# Altium schematic sheet main.SchDoc
size A2; SheetNumber: 1; SheetTotal: 10
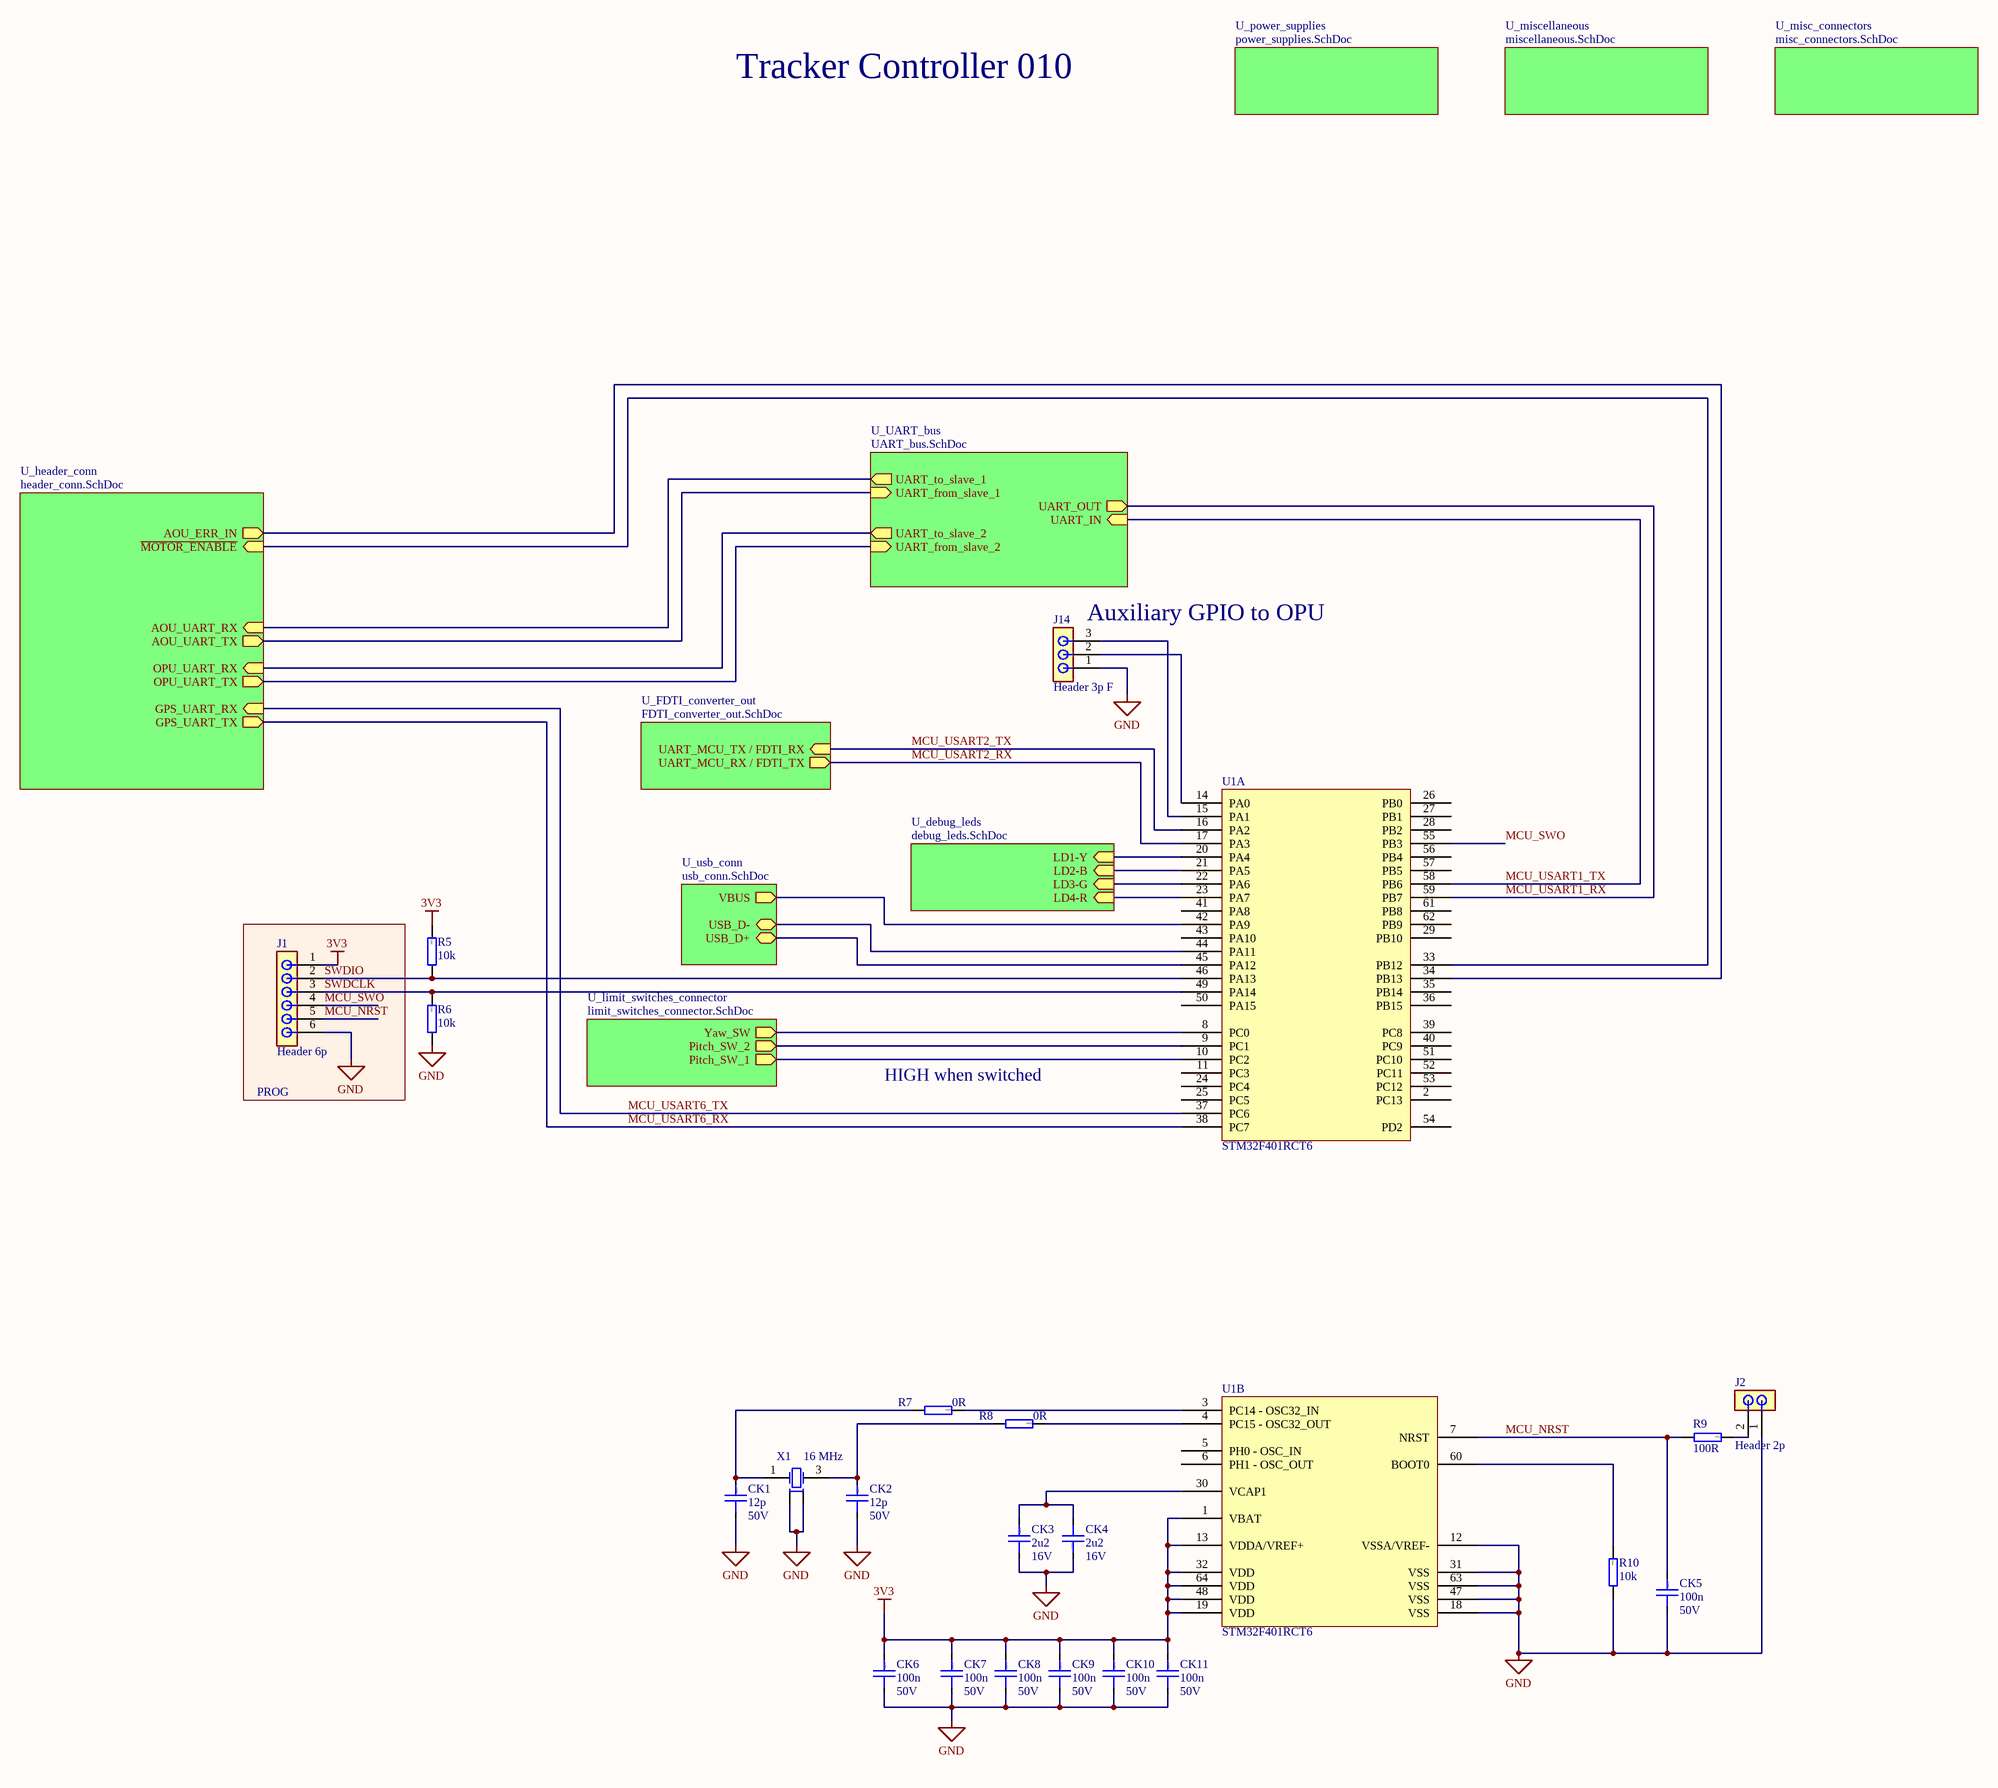
[diagram p0: main.SchDoc]

## Parts
CK1  12p  Voltage rating: 50V  [CAP0603]
CK2  12p  Voltage rating: 50V  [CAP0603]
CK3  2u2  Voltage rating: 16V  [CAP0603]
CK4  2u2  Voltage rating: 16V  [CAP0603]
CK5  100n  Voltage rating: 50V  [CAP0603]
CK6  100n  Voltage rating: 50V  [CAP0603]
CK7  100n  Voltage rating: 50V  [CAP0603]
CK8  100n  Voltage rating: 50V  [CAP0603]
CK9  100n  Voltage rating: 50V  [CAP0603]
CK10  100n  Voltage rating: 50V  [CAP0603]
CK11  100n  Voltage rating: 50V  [CAP0603]
J1  Header 6p  [Pin header 6p]
J2  Header 2p  [Pin header 2p]
J14  Header 3p F  [Pin header 3p - F]
R5  10k  [RESC2012X06N(SMR0805)]
R6  10k  [RESC2012X06N(SMR0805)]
R7  0R  [RESC2012X06N(SMR0805)]
R8  0R  [RESC2012X06N(SMR0805)]
R9  100R  [RESC2012X06N(SMR0805)]
R10  10k  [RESC2012X06N(SMR0805)]
U1  STM32F401RCT6  [LQFP64]  (parts A,B of 2)
X1  16 MHz  [3225 XTal]

## Blocks framed on the sheet
PROG: J1

## Sub-sheets
U_debug_leds = debug_leds.SchDoc: LD4-R (in), LD3-G (in), LD2-B (in), LD1-Y (in)
U_FDTI_converter_out = FDTI_converter_out.SchDoc: UART_MCU_TX / FDTI_RX (in), UART_MCU_RX / FDTI_TX (out)
U_header_conn = header_conn.SchDoc: ~{MOTOR_ENABLE} (in), AOU_ERR_IN (out), AOU_UART_RX (in), AOU_UART_TX (out), GPS_UART_RX (in), GPS_UART_TX (out), OPU_UART_RX (in), OPU_UART_TX (out)
U_limit_switches_connector = limit_switches_connector.SchDoc: Pitch_SW_1 (out), Yaw_SW (out), Pitch_SW_2 (out)
U_misc_connectors = misc_connectors.SchDoc: no entries
U_miscellaneous = miscellaneous.SchDoc: no entries
U_power_supplies = power_supplies.SchDoc: no entries
U_UART_bus = UART_bus.SchDoc: UART_IN (in), UART_OUT (out), UART_to_slave_1 (out), UART_from_slave_1 (in), UART_to_slave_2 (out), UART_from_slave_2 (in)
U_usb_conn = usb_conn.SchDoc: VBUS (out), USB_D- (bidir), USB_D+ (bidir)

## Nets
3V3: CK6.1 CK7.1 CK8.1 CK9.1 CK10.1 CK11.1 J1.1 R5.2 U1.1(VBAT) U1.13(VDDA/VREF+) U1.19(VDD) U1.32(VDD) U1.48(VDD) U1.64(VDD)
GND: CK1.2 CK2.2 CK3.2 CK4.1 CK5.2 CK6.2 CK7.2 CK8.2 CK9.2 CK10.2 CK11.2 J1.6 J2.1 J14.1 R6.1 R10.1 U1.12(VSSA/VREF-) U1.18(VSS) U1.31(VSS) U1.47(VSS) U1.63(VSS) X1.2 X1.4
MCU_NRST: CK5.1 J1.5 R9.1 U1.7(NRST)
MCU_SWO: J1.4 U1.55(PB3)
MCU_USART1_RX: U1.59(PB7) ; sheet U_UART_bus/UART_OUT
MCU_USART1_TX: U1.58(PB6) ; sheet U_UART_bus/UART_IN
MCU_USART2_RX: U1.17(PA3) ; sheet U_FDTI_converter_out/UART_MCU_RX / FDTI_TX
MCU_USART2_TX: U1.16(PA2) ; sheet U_FDTI_converter_out/UART_MCU_TX / FDTI_RX
MCU_USART6_RX: U1.38(PC7) ; sheet U_header_conn/GPS_UART_TX
MCU_USART6_TX: U1.37(PC6) ; sheet U_header_conn/GPS_UART_RX
SWDCLK: J1.3 R6.2 U1.49(PA14)
SWDIO: J1.2 R5.1 U1.46(PA13)
NetCK1_1: CK1.1 R7.1 X1.1
NetCK2_1: CK2.1 R8.1 X1.3
NetCK3_1: CK3.1 CK4.2 U1.30(VCAP1)
NetJ2_2: J2.2 R9.2
NetJ14_2: J14.2 U1.14(PA0)
NetJ14_3: J14.3 U1.15(PA1)
NetR7_2: R7.2 U1.3(PC14_-_OSC32_IN)
NetR8_2: R8.2 U1.4(PC15_-_OSC32_OUT)
NetR10_2: R10.2 U1.60(BOOT0)
NetU1_8: U1.8(PC0) ; sheet U_limit_switches_connector/Yaw_SW
NetU1_9: U1.9(PC1) ; sheet U_limit_switches_connector/Pitch_SW_2
NetU1_10: U1.10(PC2) ; sheet U_limit_switches_connector/Pitch_SW_1
NetU1_20: U1.20(PA4) ; sheet U_debug_leds/LD1-Y
NetU1_21: U1.21(PA5) ; sheet U_debug_leds/LD2-B
NetU1_22: U1.22(PA6) ; sheet U_debug_leds/LD3-G
NetU1_23: U1.23(PA7) ; sheet U_debug_leds/LD4-R
NetU1_33: U1.33(PB12) ; sheet U_header_conn/~{MOTOR_ENABLE}
NetU1_34: U1.34(PB13) ; sheet U_header_conn/AOU_ERR_IN
NetU1_42: U1.42(PA9) ; sheet U_usb_conn/VBUS
NetU1_44: U1.44(PA11) ; sheet U_usb_conn/USB_D-
NetU1_45: U1.45(PA12) ; sheet U_usb_conn/USB_D+
(unnamed): sheet U_UART_bus/UART_to_slave_1, sheet U_header_conn/AOU_UART_RX
(unnamed): sheet U_UART_bus/UART_from_slave_1, sheet U_header_conn/AOU_UART_TX
(unnamed): sheet U_UART_bus/UART_to_slave_2, sheet U_header_conn/OPU_UART_RX
(unnamed): sheet U_UART_bus/UART_from_slave_2, sheet U_header_conn/OPU_UART_TX

Not connected (* = marked no-connect by the designer): U1 2(PC13) 5(PH0_-_OSC_IN) 6(PH1_-_OSC_OUT) 11(PC3) 24(PC4) 25(PC5) 26(PB0) 27(PB1) 28(PB2) 29(PB10) 35(PB14) 36(PB15) 39(PC8) 40(PC9) 41(PA8) 43(PA10) 50(PA15) 51(PC10) 52(PC11) 53(PC12) 54(PD2) 56(PB4) 57(PB5) 61(PB8) 62(PB9)

## Notes on the sheet
- Tracker Controller 010
- (near J14) Auxiliary GPIO to OPU
- HIGH when switched
- (in symbol Cap 2u2 0603) 0603
- (in symbol Cap 12p 0603) 0603
- (in symbol Cap 100n 0603) 0603

## Library data of the parts
CK1 CK2 = Cap 12p 0603: 50V 12pF C0G ±5% 0603 Multilayer Ceramic Capacitors MLCC - SMD/SMT ROHS; Basic: Yes; Value: 12p; JLCPCB Part: C38523
CK3 CK4 = Cap 2u2 0603: 16V 2.2uF X5R ±10% 0603 Multilayer Ceramic Capacitors MLCC - SMD/SMT ROHS; Basic: Yes; Value: 2u2; JLCPCB Part: C23630
CK5-CK11 = Cap 100n 0603: 50V 100nF X7R ±10% 0603 Multilayer Ceramic Capacitors MLCC - SMD/SMT ROHS; Basic: Yes; Value: 100n; JLCPCB Part: C14663
J1 = Pin header 6p: 3A Direct Insert Policy 6P -40℃~+105℃ 2.54mm Single Row Black Brass 1x6P Plugin,P=2.54mm Pin Headers ROHS; Manufacturer_Name: Connfly; Manufacturer_Part_Number: DS1021-1*2SF11-B; Datasheet Link: https://www.tme.com/Document/cc301e58a5da78cb543a94b5a5b7f06a/DS1021.pdf; Height: 5.88mm; JLCPCB Part: C37208
J2 = Pin header 2p: Connector; Manufacturer_Name: Connfly; Manufacturer_Part_Number: DS1021-1*2SF11-B; Basic: No; Datasheet Link: https://www.tme.com/Document/cc301e58a5da78cb543a94b5a5b7f06a/DS1021.pdf; Height: 5.88mm; JLCPCB Part: C492401
J14 = Pin header 3p_F: Direct Insert 2.54mm Policy 3A 2.5mm -40℃~+105℃ 3mm 6mm 250V Black 1x3P Single Row 3P Pin Headers; Manufacturer_Name: Connfly; Manufacturer_Part_Number: DS1021-1*2SF11-B; Basic: No; Datasheet Link: https://www.tme.com/Document/cc301e58a5da78cb543a94b5a5b7f06a/DS1021.pdf; Height: 5.88mm
R5 R6 R10 = Res 10k 0805: 125mW Thick Film Resistors 150V ±100ppm/℃ ±1% 10kΩ 0805 Chip Resistor - Surface Mount ROHS; Tolerance & Rating: 1%/0.1W; Basic: Yes; Value: 10k; Package: 0805; SMD: 1; ComponentLink3Description: rezistor čip; ComponentLink3URL: heliosgreen://v1/hegMT/5-MT/Classes(343)/Folders/OpenForm?RecordNumbers=[381513]; JLCPCB Part: C17414
R7 R8 = Res 0R 0805: 125mW Thick Film Resistors 150V ±800ppm/℃ ±1% 0Ω 0805 Chip Resistor - Surface Mount ROHS; Tolerance & Rating: 1%/0.1W; Basic: YES; Value: 0R; Package: 0805; Author: JP/27.03.2014; SMD: 1; ComponentLink3Description: rezistor čip; ComponentLink3URL: heliosgreen://v1/hegMT/5-MT/Classes(343)/Folders/OpenForm?RecordNumbers=[381513]; JLCPCB Part: C17477
R9 = Res 100R 0805: 125mW Thick Film Resistors 150V ±100ppm/℃ ±1% 100Ω 0805 Chip Resistor - Surface Mount ROHS; Tolerance & Rating: 1%/0.1W; Basic: Yes; Value: 100R; Package: 0805; Author: JP/27.03.2014; SMD: 1; ComponentLink3Description: rezistor čip; ComponentLink3URL: heliosgreen://v1/hegMT/5-MT/Classes(343)/Folders/OpenForm?RecordNumbers=[381513]; JLCPCB Part: C17408
U1 = STM32F401RCT6: 256KB 1.7V~3.6V ARM-M4 64KB 84MHz FLASH 50 LQFP-64(10x10) Microcontrollers (MCU/MPU/SOC) ROHS; Basic: No; JLCPCB Part: C74524
X1 = 16 MHz crystal: X322516MLB4SI / 16MHz Surface Mount Crystal 9pF ±10ppm ±20ppm SMD3225-4P Crystals ROHS; Basic: Yes; JLCPCB: C13738